# EAGLE design pir_sensor (EAGLE 8.5.0)
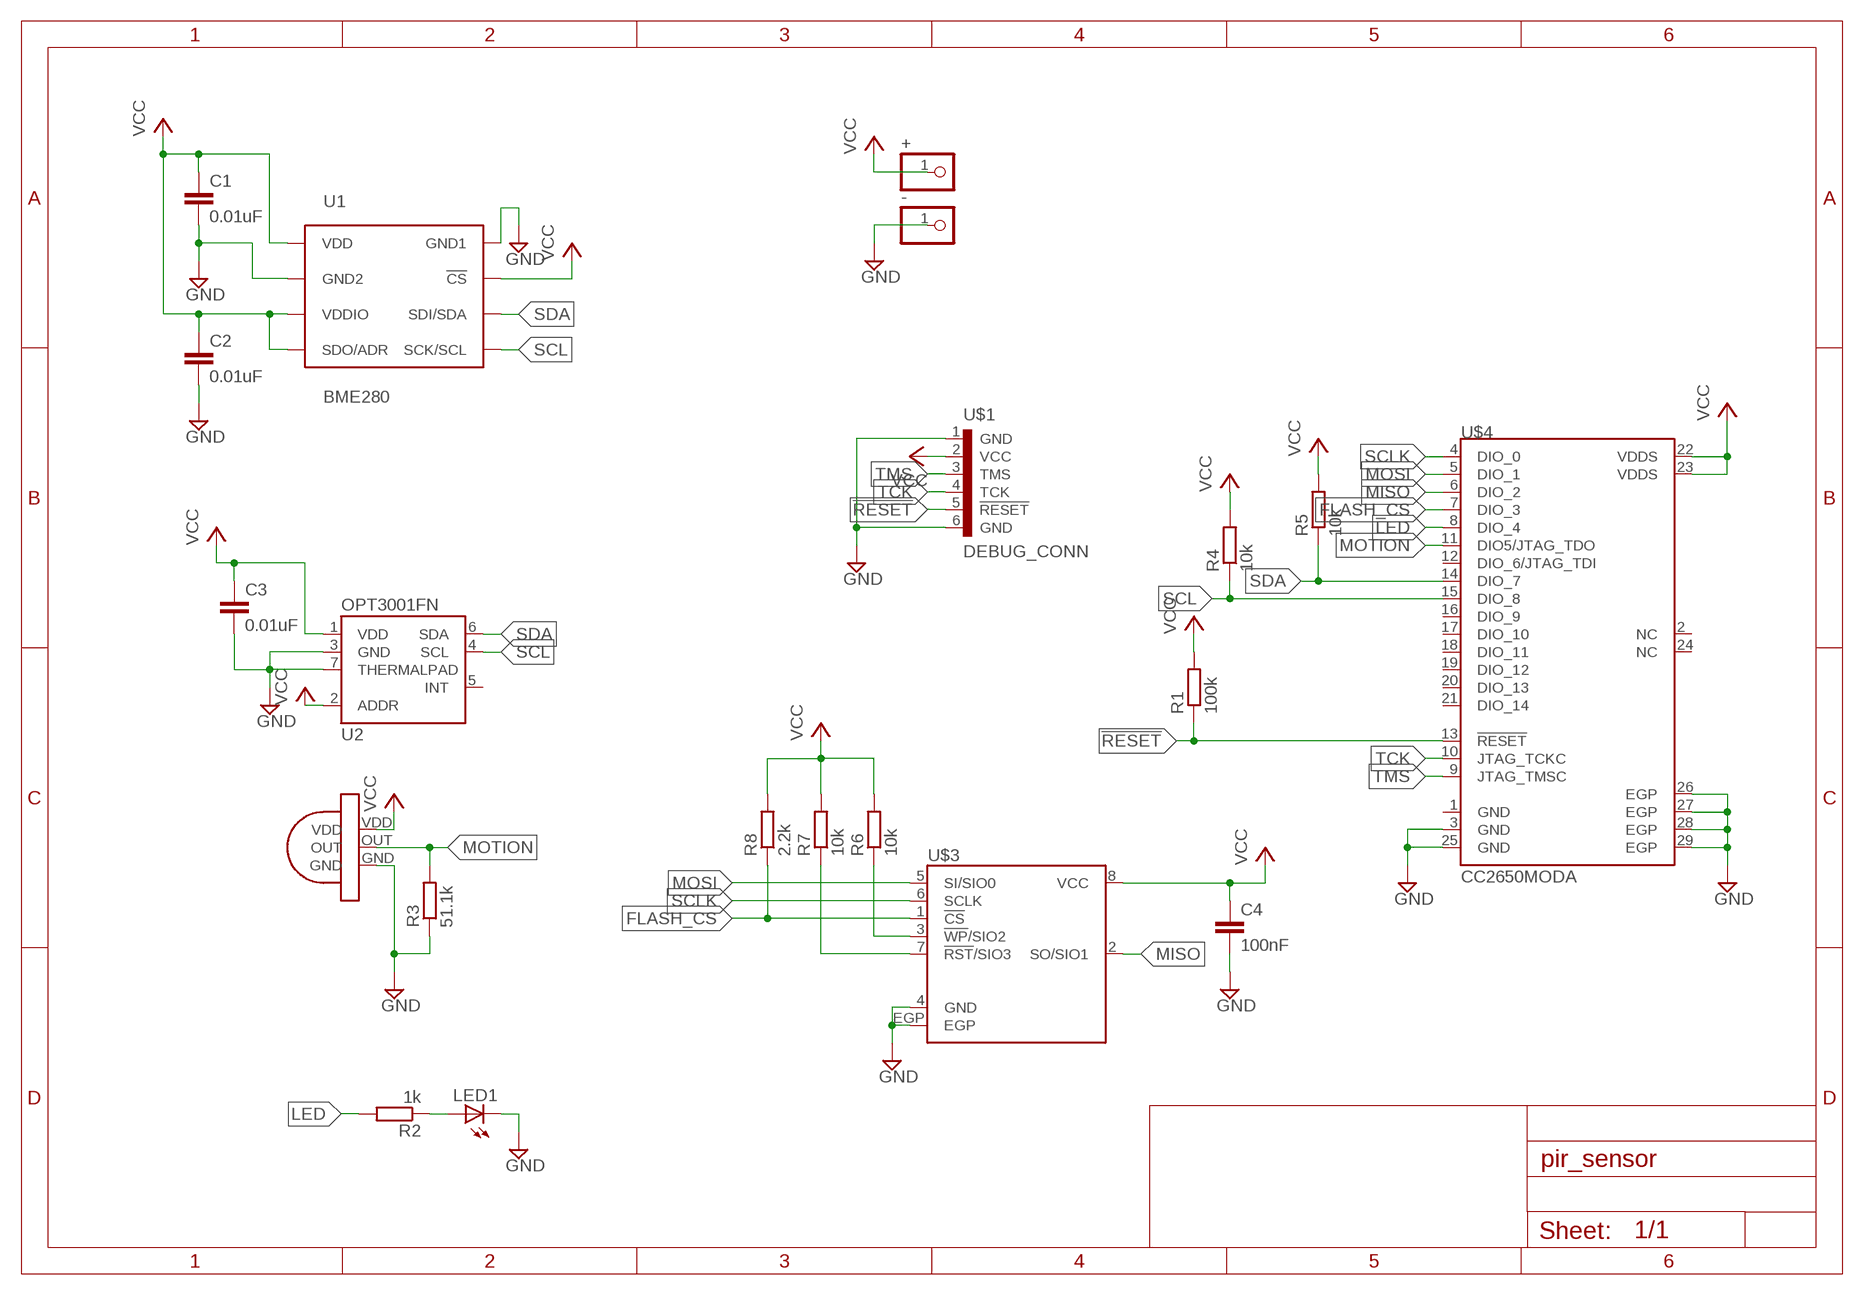
[diagram p0: schematic, sheet 1]

## Parts
+  PINHD-1X1  [1X01]
-  PINHD-1X1  [1X01]
C1  0.01uF  CAPACITOR_0402  [0402]
C2  0.01uF  CAPACITOR_0402  [0402]
C3  0.01uF  CAPACITOR_0402  [0402]
C4  100nF  CAPACITOR_0402  [0402]
LED1  LEDCHIP-LED0603  [CHIP-LED0603]
R1  100k  RESISTOR_0402  [0402]
R2  1k  RESISTOR_0402  [0402]
R3  51.1k  RESISTOR_0402  [0402]
R4  10k  RESISTOR_0402  [0402]
R5  10k  RESISTOR_0402  [0402]
R6  10k  RESISTOR_0402  [0402]
R7  10k  RESISTOR_0402  [0402]
R8  2.2k  RESISTOR_0402  [0402]
U1  BME280  [BME280_LGA]
U2  OPT3001FN  [TI-USON6-GND-PAD]
U$1  DEBUG_CONN  [DEBUG_CONN]
U$2  PAPIR  [PAPIR]
U$3  MX25R8035FMX25R8035FZUIL0  [MX25R8035FZUIL0]
U$4  CC2650MODA  [CC2650MODA]

## Nets
!RESET: R1.1 U$1.5(!RESET) U$4.13(!RESET)
FLASH_CS: R8.1 U$3.1(!CS) U$4.7(DIO_3)
GND: -.1 C1.2 C2.2 C3.2 C4.2 LED1.C R3.1 U1.P$1(GND1) U1.P$7(GND2) U2.3(GND) U2.7(THERMALPAD) U$1.1(GND) U$1.6(GND) U$2.GND U$3.4(GND) U$3.EGP U$4.3(GND) U$4.25(GND) U$4.26(EGP) U$4.27(EGP) U$4.28(EGP) U$4.29(EGP)
LED: R2.2 U$4.8(DIO_4)
MISO: U$3.2(SO/SIO1) U$4.6(DIO_2)
MOSI: U$3.5(SI/SIO0) U$4.5(DIO_1)
MOTION: R3.2 U$2.OUT U$4.11(DIO5/JTAG_TDO)
N$1: R6.1 U$3.3(!WP!/SIO2)
N$2: R7.1 U$3.7(!RST!/SIO3)
N$3: LED1.A R2.1
SCL: R4.1 U1.P$4(SCK/SCL) U2.4(SCL) U$4.15(DIO_8)
SCLK: U$3.6(SCLK) U$4.4(DIO_0)
SDA: R5.1 U1.P$3(SDI/SDA) U2.6(SDA) U$4.14(DIO_7)
TCK: U$1.4(TCK) U$4.10(JTAG_TCKC)
TMS: U$1.3(TMS) U$4.9(JTAG_TMSC)
VCC: +.1 C1.1 C2.1 C3.1 C4.1 R1.2 R4.2 R5.2 R6.2 R7.2 R8.2 U1.P$2(!CS) U1.P$5(SDO/ADR) U1.P$6(VDDIO) U1.P$8(VDD) U2.1(VDD) U2.2(ADDR) U$1.2(VCC) U$2.VDD U$3.8(VCC) U$4.22(VDDS) U$4.23(VDDS)
Unconnected: U2.5(INT) U$4.2(NC) U$4.12(DIO_6/JTAG_TDI) U$4.16(DIO_9) U$4.17(DIO_10) U$4.18(DIO_11) U$4.19(DIO_12) U$4.20(DIO_13) U$4.21(DIO_14) U$4.24(NC)

## Power pins joined to a net without a drawn wire
GND: U$4.1(GND)

## Library data of the parts
+ - = pinhead:PINHD-1X1: PIN HEADER
C1-C4 = mine:CAPACITOR
LED1 = adafruit:LED: LED OSRAM: - CHIPLED LG R971, LG N971, LY N971, LG Q971, LY Q971, LO R971, LY R971 LH N974, LH R974 LS Q976, LO Q976, LY Q976 LO Q996 - Hyper CHIPLED LW Q18S LB Q993, LB Q99A, LB R99A - SideLED LS A670, LO A670, LY A670, LG A670, LP A670 LB A673, LV A673, LT A673, LW A673 LH A674 LY A675 LS A676, LA A676, LO A676, LY A676, LW A676 LS A679, LY A679, LG A679 - Hyper Micro SIDELED® LS Y876, LA Y876, LO Y876, LY Y876 LT Y87S - SmartLED LW L88C, LW L88S LB L89C, LB L89S, LG L890 LS L89K, LO L89K, LY L89K LS L896, LA L896, LO L896, LY L896 - TOPLED LS T670, LO T670, LY T670, LG T670, LP T670 LSG T670, LSP T670, LSY T670, LOP T670, LYG T670 LG T671, LOG T671, LSG T671 LB T673, LV T673, LT T673, LW T673 LH T674 LS T676, LA T676, LO T676, LY T676, LB T676, LH T676, LSB T676, LW T676 LB T67C, LV T67C, LT T67C, LS T67K, LO T67K, LY T67K, LW E67C LS E67B, LA E67B, LO E67B, LY E67B, LB E67C, LV E67C, LT E67C LW T67C LS T679, LY T679, LG T679 LS T770, LO T770, LY T770, LG T770, LP T770 LB T773, LV T773, LT T773, LW T773 LH T774 LS E675, LA E675, LY E675, LS T675 LS T776, LA T776, LO T776, LY T776, LB T776 LHGB T686 LT T68C, LB T68C - Hyper Mini TOPLED® LB M676 - Mini TOPLED Santana® LG M470 LS M47K, LO M47K, LY M47K Source: http://www.osram.convergy.de/
R1-R8 = mine:RESISTOR
U1 = BME280ComponentLibrary:BME280; PROD_ID: IC-13090
U2 = adam-sensors:OPT3001: OPT3001.
U$1 = mine:DEBUG_CONN
U$2 = mine:PAPIR
U$3 = mine:MX25R8035F
U$4 = mine:CC2650MODA

## Board
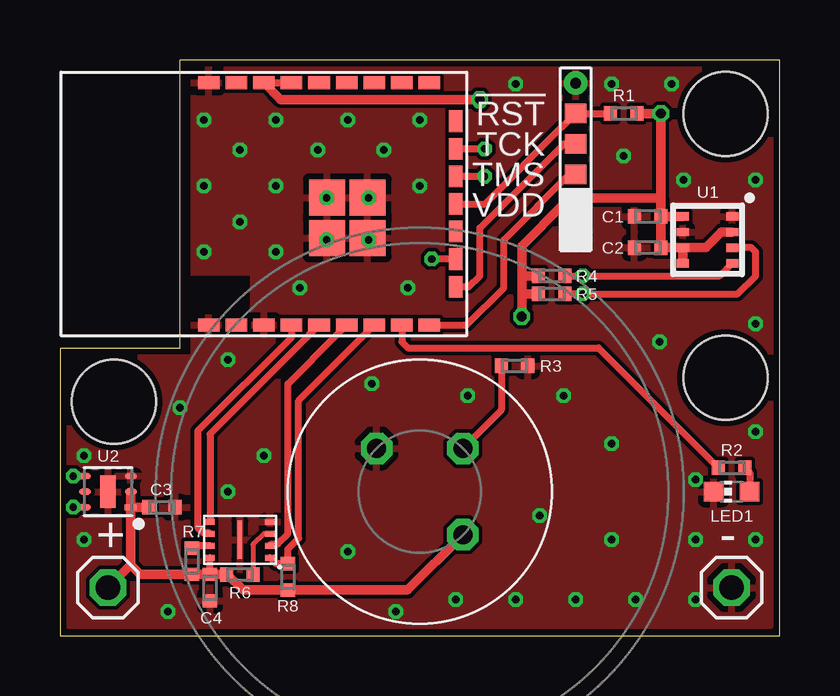
[diagram p1: board, top side]
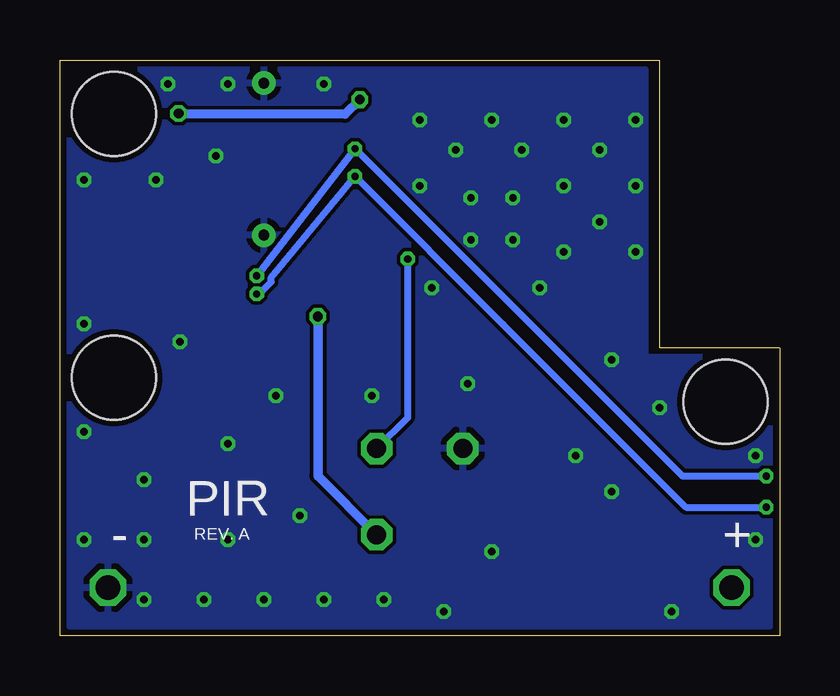
[diagram p2: board, bottom side, seen from below]

Size 30 x 24 mm. Coordinates in mm from the lower left corner, seen from the top.
Outline: 0,0 30,0 30,24 5,24 5,12 0,12 0,0
Copper layers (1*16): Top 0.035mm / dielectric 1.5mm / Bottom 0.035mm
Design rules "SeeedStudio_2layer_DRU_no_angle_20140221_fixed_drill_size": minimum track width 6mil, minimum drill 0.3mm, track to track 6mil, track to pad 6mil, pad to pad 6mil, via to via 6mil, smd to smd 0mil, copper to edge 10mil, drill to drill 10mil, minimum pad ring 10mil, minimum via ring 6mil, stop-mask expansion 2mil, vias tented up to drill 100mil, thermal gap 10mil
Holes 3.5 mm at 2.25,9.75 27.75,21.75 27.75,10.75

### Footprints (pad centres in the part's own frame; a part is rotated, then mirrored left to right if it is on the bottom)
1X01 = drill 1.016 octagon: 1 0,0
0402 = smd 0.55 x 0.6: 1 -0.55,0; 2 0.55,0
CHIP-LED0603 = smd 0.8 x 0.8: A 0,-0.75; C 0,0.75
BME280_LGA = smd 0.5 x 0.35: P$1 1.025,0.975; P$2 1.025,0.325; P$3 1.025,-0.325; P$4 1.025,-0.975; P$5 -1.025,-0.975; P$6 -1.025,-0.325; P$7 -1.025,0.325; P$8 -1.025,0.975
TI-USON6-GND-PAD = smd 0.5 x 0.25: 1 -0.95,0.65; 2 -0.95,0; 3 -0.95,-0.65; 4 0.95,-0.65; 5 0.95,0; 6 0.95,0.65 | smd 0.65 x 1.35: 7 0,0
DEBUG_CONN = drill 0.457: 1 0,3.81; 6 0,-2.54 | smd 0.889 x 0.813: 2 0,2.54; 3 0,1.27; 4 0,0; 5 0,-1.27
PAPIR = drill 0.8 octagon: GND 1.796,1.796; OUT 1.796,-1.796; VDD -1.796,-1.796
MX25R8035FZUIL0 = smd 0.25 x 0.4: 1 0.75,1.25; 2 0.25,1.25; 3 -0.25,1.25; 4 -0.75,1.25; 5 -0.75,-1.25; 6 -0.25,-1.25; 7 0.25,-1.25; 8 0.75,-1.25 | smd 1.6 x 0.2: EGP 0,0
CC2650MODA = smd 0.55 x 0.9: 1 -5.05,2.3; 2 -5.05,1.15; 3 -5.05,0; 4 -5.05,-1.15; 5 -5.05,-2.3; 6 -5.05,-3.45; 7 -5.05,-4.6; 8 -5.05,-5.75; 9 -5.05,-6.9; 17 5.05,-6.9; 18 5.05,-5.75; 19 5.05,-4.6; 20 5.05,-3.45; 21 5.05,-2.3; 22 5.05,-1.15; 23 5.05,0; 24 5.05,1.15; 25 5.05,2.3 | smd 0.9 x 0.55: 10 -3.45,-8; 11 -2.3,-8; 12 -1.15,-8; 13 0,-8; 14 1.15,-8; 15 2.3,-8; 16 3.45,-8 | smd 1.5 x 1.5: 26 -1.435,-2.625; 27 -1.435,-4.325; 28 0.265,-4.325; 29 0.265,-2.625

### Placement (x,y rotation side)
+  2,2 0 top
-  28,2 0 top
C1  24.5,17.48 180 top
C2  24.5,16.18 180 top
C3  4.25,5.35 0 top
C4  6.25,2 270 top
LED1  28,6 90 top
R1  23.5,21.77 0 top
R2  28,7 180 top
R3  18.95,11.25 180 top
R4  20.5,15 180 top
R5  20.5,14.24 180 top
R6  7.5,2.55 180 top
R7  5.5,3.1 270 top
R8  9.5,2.45 270 top
U1  27,16.5 0 top
U2  2,6 180 top
U$1  21.5,20.5 180 top
U$2  15,6 90 top
U$3  7.5,4 270 top
U$4  8.5,18 90 top

### Tracks (layer width: path | path; a pad name or v marks a point on that pad's centre or on a via)
!RESET
  Top 0.3: U$4.13 17.72,18 20.93,21.21 20.94,21.21 U$1.5 R1.1
FLASH_CS
  Top 0.3: U$3.1 9,3 R8.1 9.5,3.61 9.95,4.06 9.95,9.8 12.7,12.55 U$4.7
GND  (via drill 0.3)
  other vias: 11.12,18.25 12.87,18.25 11.12,16.5 12.87,16.5 6,21.5 6,18.75 6,16 9,21.5 12,21.5 9,18.75 9,16 15,21.5 15,18.75 14.5,14.5 7.5,20.25 10.75,20.25 13.5,20.25 7.5,17.25 19,23 23,23 23.5,20 29,19 25,12.25 5,9.5 21.5,1.5 24,1.5 19,1.5 16.5,1.5 14,1 1,7.5 1,4 26.5,1.5 26.5,4 26.5,6.5 29,4 29,8.5 29,13 26,19 25.5,23 21,10 20,5 23,4 23,8 7,6 8.5,7.5 10,14.5 12,3.5 13,10.5 7,11.5 4.5,1 17,10
  pour Bottom: 0.4,0.4 0.4,11.6 5.6,11.6 5.6,23.6 29.6,23.6 29.6,0.4
  pour Top: 0.4,0.4 0.4,11.6 5.6,11.6 5.6,23.6 29.6,23.6 29.6,0.4
LED
  Top 0.3: U$4.8 14.25,12.25 14.5,12 22.45,12 R2.2
MISO
  Top 0.3: U$3.2 8.82,3.82 9.07,3.82 9.5,4.25 9.5,10.5 11.55,12.55 U$4.6
MOSI
  Top 0.3: U$4.5 10.4,12.55 6.25,8.4 U$3.5
MOTION  (via drill 0.3)
  Top 0.3: R3.2 18.4,9.4 U$2.OUT | U$4.11 v15.5,15.7
  Bottom 0.3: U$2.OUT 15.5,9.09 v15.5,15.7
N$1
  Top 0.2: U$3.3 8.5,4.25 8.05,3.8 R6.1
N$2
  Top 0.3: U$3.7 5.6,3.75 R7.1
N$3
  Top 0.3: R2.1 28.75,6.8 LED1.A
SCL  (via drill 0.3)
  Top 0.3: U1.P$4 27.5,15 v21.8,15 R4.1 | U$4.15 v17.7,20.3 | v0.56,6.65 U2.4
  Bottom 0.3: v21.8,15 v17.7,20.3 4.05,6.65 v0.56,6.65
SCLK
  Top 0.3: U$3.6 6.2,4.3 5.95,4.3 5.75,4.5 5.75,8.54 9.65,12.44 U$4.4
SDA  (via drill 0.3)
  Top 0.3: U1.P$3 28.82,16.18 29,16 29,15 28.24,14.24 v21.8,14.24 R5.1 | U$4.14 v17.7,19.15 | U2.6 v0.56,5.35
  Bottom 0.3: v21.8,14.24 21.65,14.39 21.55,14.39 21.2,14.75 21.2,14.93 v17.7,19.15 11.53,12.97 3.9,5.35 v0.56,5.35
TCK
  Top 0.3: U$1.4 21,20.5 17.5,17 17.5,15 17.05,14.55 U$4.10
TMS
  Top 0.3: U$4.9 16.95,12.95 18.5,14.5 18.5,16.5 21.23,19.23 U$1.3
VCC  (via drill 0.4)
  Top 0.3: U$4.23 U$4.22 | C4.1 U$3.8
  Top 0.4: U$4.23 9.2,22.35 v17.5,22.35 | 25.05,18.25 C1.1 | U1.P$8 C1.1 | U1.P$6 C2.1 C1.1 | U1.P$6 U1.P$5 | 25.05,18.25 21.79,18.25 U$1.2 20.96,17.96 19.25,16.25 19.25,15 | U2.1 C3.1 | U2.2 U2.1 | +.1 2.95,2.95 | 2.95,2.95 U2.1 | U1.P$6 26.93,16.18 27.57,16.82 U1.P$2 | R1.2 v25.05,21.77 25.05,18.25 | 19.25,15 19.25,14.24 | 19.25,14.24 v19.25,13.3 | 2.95,2.95 3.35,2.55 R7.2 C4.1 R6.2 6.98,2.55 7.63,1.9 R8.2 14.49,1.9 U$2.VDD | R4.2 19.25,15 | R5.2 19.25,14.24
  Bottom 0.4: v25.05,21.77 18.12,21.73 v17.5,22.35 | v19.25,13.3 19.25,6.66 U$2.VDD

### Text on the board
bPlace: PIR | + | REV. A | -